# EAGLE design Node (EAGLE 6.1)
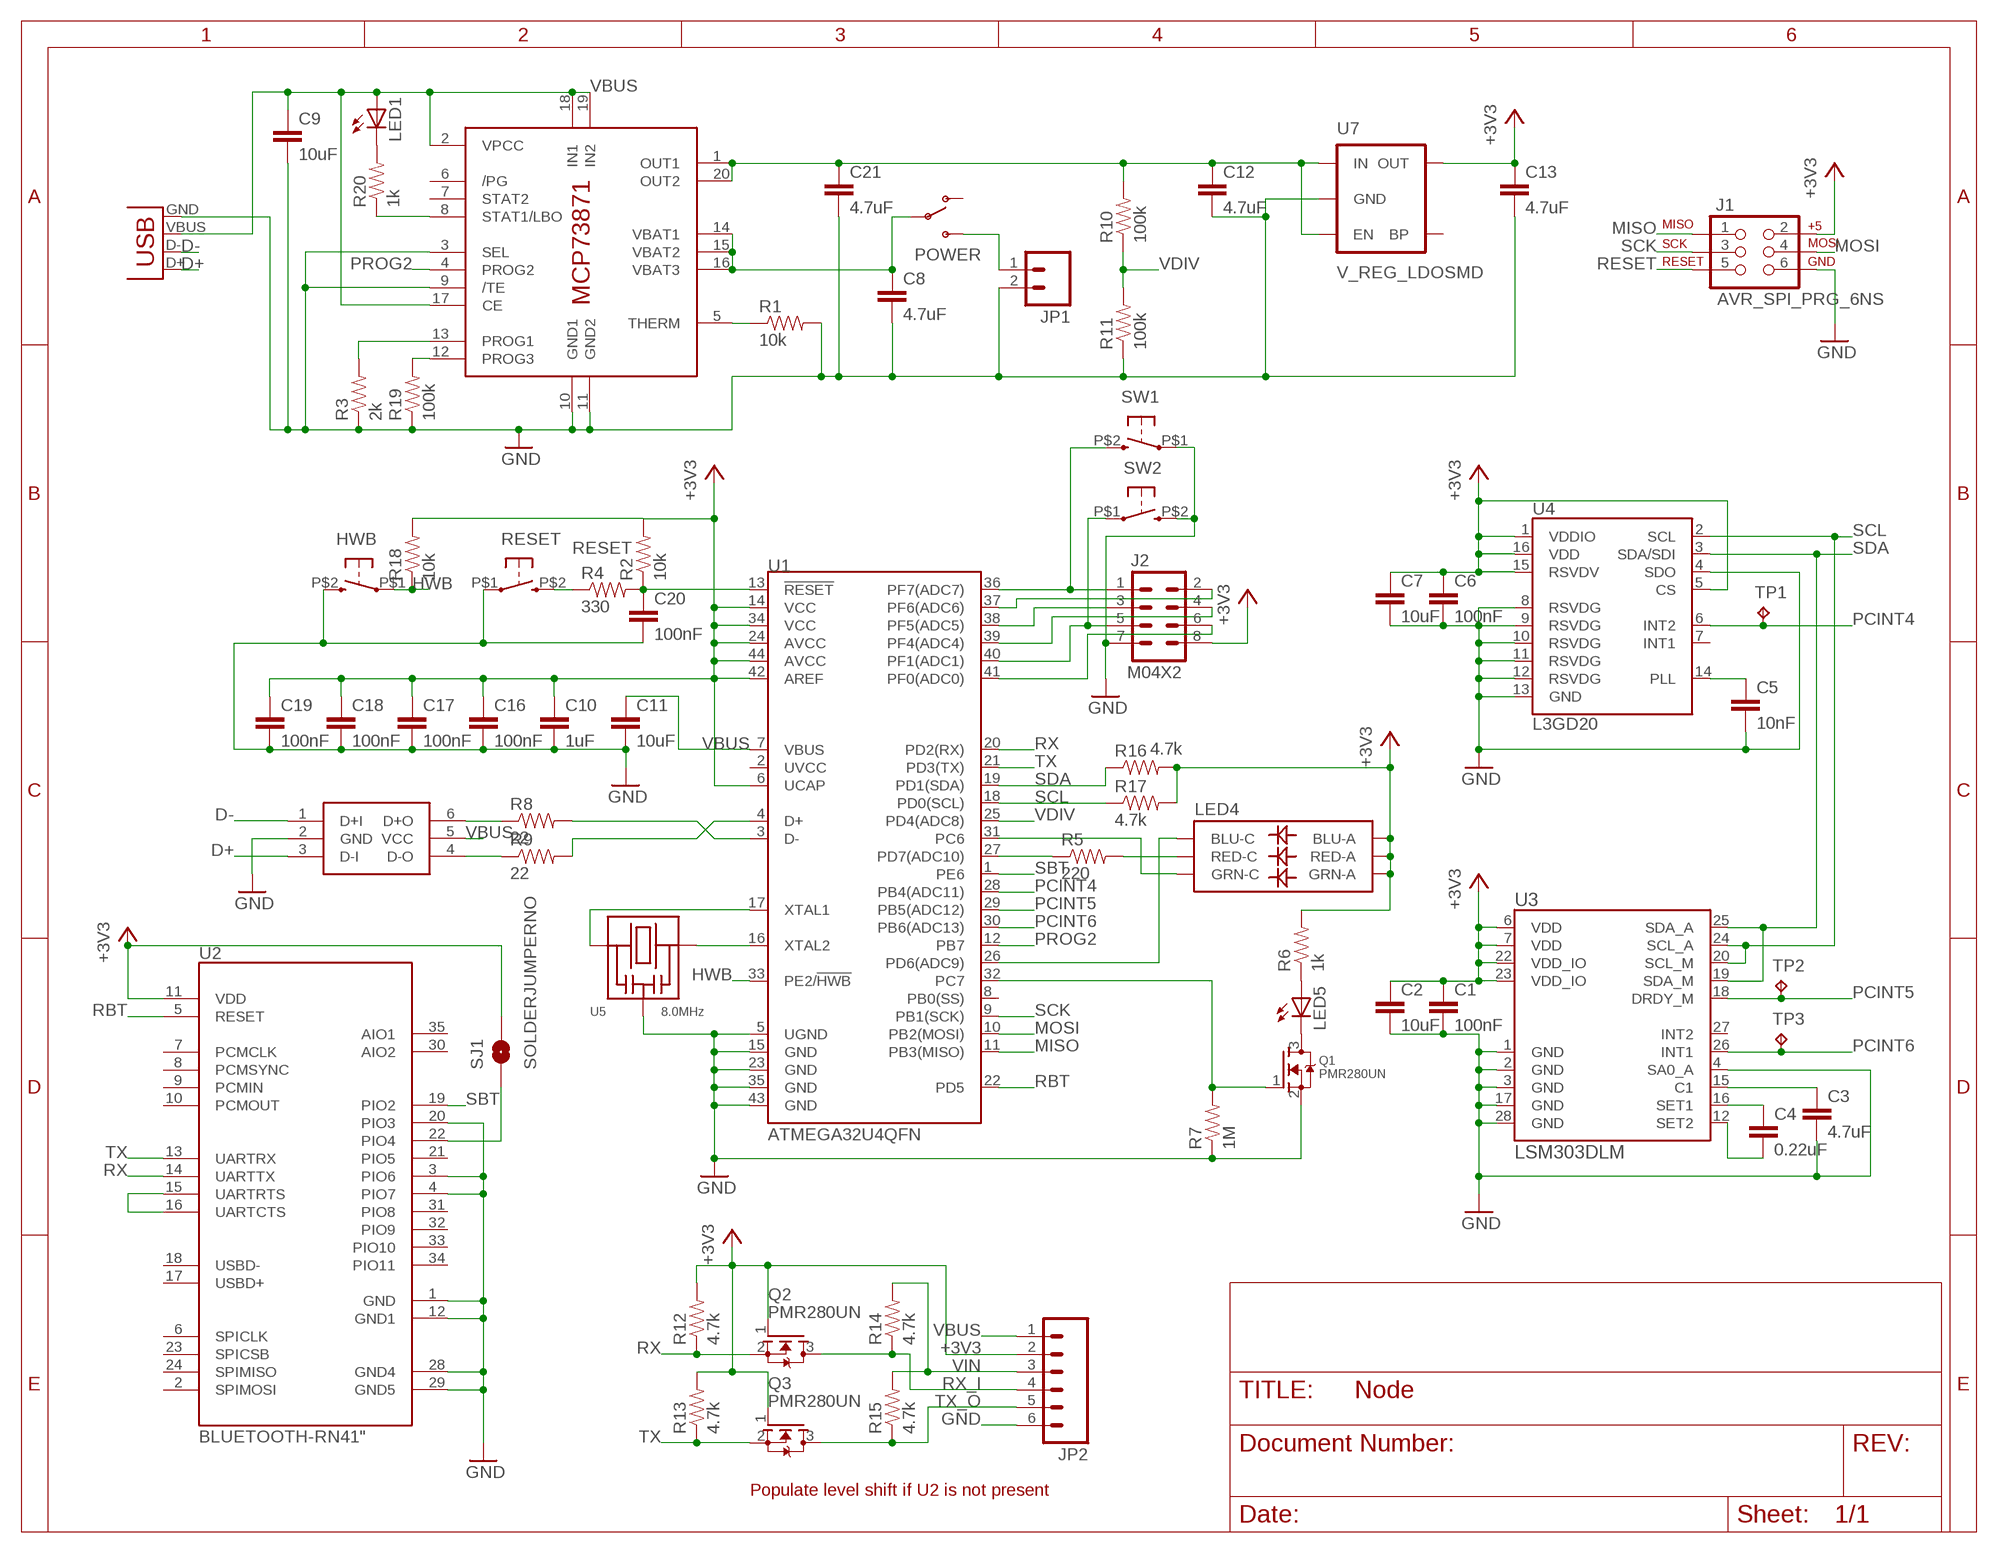
[diagram p0: schematic, sheet 1]

## Parts
C1  100nF  CAP0402-CAP  [0402-CAP]
C2  10uF  CAP0603-CAP  [0603-CAP]
C3  4.7uF  CAP0603-CAP  [0603-CAP]
C4  0.22uF  CAP0402-CAP  [0402-CAP]
C5  10nF  CAP0402-CAP  [0402-CAP]
C6  100nF  CAP0402-CAP  [0402-CAP]
C7  10uF  CAP0603-CAP  [0603-CAP]
C8  4.7uF  CAP0603-CAP  [0603-CAP]
C9  10uF  CAP0603-CAP  [0603-CAP]
C10  1uF  CAP0402-CAP  [0402-CAP]
C11  10uF  CAP0603-CAP  [0603-CAP]
C12  4.7uF  CAP0603-CAP  [0603-CAP]
C13  4.7uF  CAP0603-CAP  [0603-CAP]
C16  100nF  CAP0402-CAP  [0402-CAP]
C17  100nF  CAP0402-CAP  [0402-CAP]
C18  100nF  CAP0402-CAP  [0402-CAP]
C19  100nF  CAP0402-CAP  [0402-CAP]
C20  100nF  CAP0402-CAP  [0402-CAP]
C21  4.7uF  CAP0603-CAP  [0603-CAP]
HWB  KSS  [KSS]
J1  AVR_SPI_PRG_6NS  [2X3-NS]
J2  M04X2  [2X4]
JP1  M02-JST-2MM-SMT  [JST-2-SMD]
JP2  M06SIP  [1X06]
LED1  LED0603  [LED-0603]
LED4  LED-TRICOLOR-5050LED-TRICOLOR-0606  [0606]
LED5  LED0603  [LED-0603]
POWER  SWITCH-SPST-SMD-A  [SWITCH-SPST-SMD-A]
Q1  PMR280UN  MOSFET-N  [SOT416]
Q2  PMR280UN  MOSFET-N  [SOT416]
Q3  PMR280UN  MOSFET-N  [SOT416]
R1  10k  RESISTOR0402-RES  [0402-RES]
R2  10k  RESISTOR0402-RES  [0402-RES]
R3  2k  RESISTOR0402-RES  [0402-RES]
R4  330  RESISTOR0402-RES  [0402-RES]
R5  220  RESISTOR0402-RES  [0402-RES]
R6  1k  RESISTOR0402-RES  [0402-RES]
R7  1M  RESISTOR0402-RES  [0402-RES]
R8  22  RESISTOR0402-RES  [0402-RES]
R9  22  RESISTOR0402-RES  [0402-RES]
R10  100k  RESISTOR0402-RES  [0402-RES]
R11  100k  RESISTOR0402-RES  [0402-RES]
R12  4.7k  RESISTOR0402-RES  [0402-RES]
R13  4.7k  RESISTOR0402-RES  [0402-RES]
R14  4.7k  RESISTOR0402-RES  [0402-RES]
R15  4.7k  RESISTOR0402-RES  [0402-RES]
R16  4.7k  RESISTOR0402-RES  [0402-RES]
R17  4.7k  RESISTOR0402-RES  [0402-RES]
R18  10k  RESISTOR0402-RES  [0402-RES]
R19  100k  RESISTOR0402-RES  [0402-RES]
R20  1k  RESISTOR0402-RES  [0402-RES]
RESET  KSS  [KSS]
SJ1  SOLDERJUMPERNO  [SJ_2S-NO]
SW1  KSS  [KSS]
SW2  KSS  [KSS]
TP1  TPTP06R  [TP06R]
TP2  TPTP06R  [TP06R]
TP3  TPTP06R  [TP06R]
U1  ATMEGA32U4QFN  [QFN-44]
U2  BLUETOOTH-RN41"  [RN41]
U3  LSM303DLM  [LGA28-5X5]
U4  L3GD20  [LGA16-4X4]
U5  8.0MHz  RESONATOR  [SMT_RESONATOR_3731]
U6  MCP73871  [QFN20]
U7  V_REG_LDOSMD  [SOT23-5]
U9  RCLAMP0502A  [SOT-666]
X1  USBSMD  [USB-MINIB]

## Nets
+3V3: C1.1 C2.1 C6.1 C7.1 C10.1 C13.1 C16.1 C17.1 C18.1 C19.1 J1.2 J2.8 JP2.2 LED4.4(BLU-A) LED4.5(RED-A) LED4.6(GRN-A) Q2.1(G) Q3.1(G) R2.2 R6.2 R12.2 R13.2 R16.2 R17.2 R18.2 SJ1.2 U1.6(UCAP) U1.14(VCC) U1.24(AVCC) U1.34(VCC) U1.42(AREF) U1.44(AVCC) U2.11(VDD) U3.6(VDD) U3.7(VDD) U3.22(VDD_IO) U3.23(VDD_IO) U4.1(VDDIO) U4.5(CS) U4.15(RSVDV) U4.16(VDD) U7.5(OUT)
D+: U9.3(D-I) X1.D+
D-: U9.1(D+I) X1.D-
GND: C1.2 C2.2 C3.2 C5.2 C6.2 C7.2 C8.2 C9.2 C10.2 C11.2 C12.2 C13.2 C16.2 C17.2 C18.2 C19.2 C20.2 C21.2 HWB.P$2 J1.6 J2.7 JP1.2 JP2.6 Q1.2(S) R1.2 R3.1 R7.1 R11.1 R19.1 RESET.P$1 SW1.P$1 SW2.P$2 U1.5(UGND) U1.15(GND) U1.23(GND) U1.35(GND) U1.43(GND) U2.1(GND) U2.3(PIO6) U2.4(PIO7) U2.12(GND1) U2.20(PIO3) U2.28(GND4) U2.29(GND5) U3.1(GND) U3.2(GND) U3.3(GND) U3.4(SA0_A) U3.17(GND) U3.28(GND) U4.4(SDO) U4.8(RSVDG) U4.9(RSVDG) U4.10(RSVDG) U4.11(RSVDG) U4.12(RSVDG) U4.13(GND) U5.P$2(GND) U6.3(SEL) U6.9(/TE) U6.10(GND1) U6.11(GND2) U7.2(GND) U9.2(GND) X1.GND
HWB: HWB.P$1 R18.1 U1.33(PE2/!HWB)
MISO: J1.1 U1.11(PB3(MISO))
MOSI: J1.4 U1.10(PB2(MOSI))
N$1: U1.16(XTAL2) U5.P$3
N$2: U1.17(XTAL1) U5.P$1
N$3: C3.1 U3.15(C1)
N$4: C8.1 POWER.2(P) U6.14(VBAT1) U6.15(VBAT2) U6.16(VBAT3)
N$5: C4.1 U3.16(SET1)
N$6: C4.2 U3.12(SET2)
N$7: C5.1 U4.14(PLL)
N$8: R1.1 U6.5(THERM)
N$9: U2.15(UARTRTS) U2.16(UARTCTS)
N$10: LED4.2(RED-C) R5.2
N$11: C12.1 C21.1 R10.2 U6.1(OUT1) U6.20(OUT2) U7.1(IN) U7.3(EN)
N$12: LED4.3(GRN-C) U1.31(PC6)
N$13: LED1.C R20.2
N$14: SJ1.1 U2.22(PIO4)
N$15: R8.2 U1.3(D-)
N$16: R3.2 U6.13(PROG1)
N$17: LED4.1(BLU-C) U1.26(PD6(ADC9))
N$18: R5.1 U1.27(PD7(ADC10))
N$19: R20.1 U6.8(STAT1/LBO)
N$20: LED5.C Q1.3(D)
N$21: LED5.A R6.1
N$22: Q1.1(G) R7.2 U1.32(PC7)
N$24: R9.2 U1.4(D+)
N$25: R8.1 U9.6(D+O)
N$26: R9.1 U9.4(D-O)
N$27: C20.1 R2.1 R4.2 U1.13(!RESET)
N$28: J2.1 SW1.P$2 U1.36(PF7(ADC7))
N$29: JP1.1 POWER.3(S)
N$30: J2.2 U1.37(PF6(ADC6))
N$32: J2.3 U1.38(PF5(ADC5))
N$33: J2.4 U1.39(PF4(ADC4))
N$34: J2.5 SW2.P$1 U1.40(PF1(ADC1))
N$35: J2.6 U1.41(PF0(ADC0))
N$36: R19.2 U6.12(PROG3)
PCINT4: TP1.TP U1.28(PB4(ADC11)) U4.6(INT2)
PCINT5: TP2.TP U1.29(PB5(ADC12)) U3.18(DRDY_M)
PCINT6: TP3.TP U1.30(PB6(ADC13)) U3.26(INT1)
PROG2: U1.12(PB7) U6.4(PROG2)
RBT: U1.22(PD5) U2.5(RESET)
RESET: J1.5 R4.1 RESET.P$2
RX: Q2.2(S) R12.1 U1.20(PD2(RX)) U2.14(UARTTX)
RX_I: JP2.4 Q2.3(D) R14.1
SBT: U1.1(PE6) U2.19(PIO2)
SCK: J1.3 U1.9(PB1(SCK))
SCL: R17.1 U1.18(PD0(SCL)) U3.20(SCL_M) U3.24(SCL_A) U4.2(SCL)
SDA: R16.1 U1.19(PD1(SDA)) U3.19(SDA_M) U3.25(SDA_A) U4.3(SDA/SDI)
TX: Q3.2(S) R13.1 U1.21(PD3(TX)) U2.13(UARTRX)
TX_O: JP2.5 Q3.3(D) R15.1
VBUS: C9.1 C11.1 JP2.1 LED1.A U1.7(VBUS) U6.2(VPCC) U6.17(CE) U6.18(IN1) U6.19(IN2) U9.5(VCC) X1.VBUS
VDIV: R10.1 R11.2 U1.25(PD4(ADC8))
VIN: JP2.3 R14.2 R15.2
Unconnected: POWER.1(O) U1.2(UVCC) U1.8(PB0(SS)) U2.2(SPIMOSI) U2.6(SPICLK) U2.7(PCMCLK) U2.8(PCMSYNC) U2.9(PCMIN) U2.10(PCMOUT) U2.17(USBD+) U2.18(USBD-) U2.21(PIO5) U2.23(SPICSB) U2.24(SPIMISO) U2.30(AIO2) U2.31(PIO8) U2.32(PIO9) U2.33(PIO10) U2.34(PIO11) U2.35(AIO1) U3.27(INT2) U4.7(INT1) U6.6(/PG) U6.7(STAT2) U7.4(BP)

## Notes on the sheet
- Populate level shift if U2 is not present

## Library data of the parts
C1-C13 C16-C21 = SparkFun:CAP: Capacitor Standard 0603 ceramic capacitor, and 0.1" leaded capacitor.
HWB RESET SW1 SW2 = adjacent-reality:KSS: KSS Series Subminiature SMT Side Actuated Momentary Tactile Switch
J1 = SparkFun:AVR_SPI_PRG_6: AVR ISP 6 Pin This is the reduced ISP connector for AVR programming. Common on Arduino. This footprint will take up less PCB space and can be used with a 10-pin to 6-pin adapter such as SKU: BOB-08508
J2 = SparkFun:M04X2
JP1 = SparkFun:M02: Header 2 Standard 2-pin 0.1" header. Use with straight break away headers (SKU : PRT-00116), right angle break away headers (PRT-00553), swiss pins (PRT-00743), machine pins (PRT-00117), and female headers (PRT-00115). Molex polarized connector foot print use with SKU : PRT-08233 with associated crimp pins and housings.
JP2 = SparkFun:M06: Header 6 Standard 6-pin 0.1" header. Use with straight break away headers (SKU : PRT-00116), right angle break away headers (PRT-00553), swiss pins (PRT-00743), machine pins (PRT-00117), and female headers (PRT-00115). Molex polarized connector foot print use with SKU : PRT-08094 with associated crimp pins and housings. NOTES ON THE VARIANTS LOCK and LOCK_LONGPADS... This footprint was designed to help hold the alignment of a through-hole component (i.e. 6-pin header) while soldering it into place. You may notice that each hole has been shifted either up or down by 0.005 of an inch from it's more standard position (which is a perfectly straight line). This slight alteration caused the pins (the squares in the middle) to touch the edges of the holes. Because they are alternating, it causes a "brace" to hold the component in place. 0.005 has proven to be the perfect amount of "off-center" position when using our standard breakaway headers. Although looks a little odd when you look at the bare footprint, once you have a header in there, the alteration is very hard to notice. Also, if you push a header all the way into place, it is covered up entirely on the bottom side. This idea of altering the position of holes to aid alignment will be further integrated into the Sparkfun Library for other footprints. It can help hold any component with 3 or more connection pins.
LED1 LED5 = SparkFun:LED: LEDs Standard schematic elements and footprints for 5mm, 3mm, 1206, and 0603 sized LEDs. 5mm - Spark Fun Electronics SKU : COM-00529 (and others)
LED4 = adjacent-reality:LED-TRICOLOR-5050
POWER = SparkFun:SWITCH-SPST: SPST Switch Simple slide switch. Spark Fun Electronics SKU : COM-00102
Q1-Q3 = adjacent-reality:MOSFET-N: N-Channel Mosfet 2N7002E - 60V 260mA SOT23 [Digikey: 2N7002ET1GOSTR-ND] - REEL BSH103 - 30V 850mA SOT23 [Digikey: 568-5013-1-ND]
R1-R20 = SparkFun:RESISTOR: Resistor Basic schematic elements and footprints for 0603, 1206, and PTH resistors.
SJ1 = SparkFun:SOLDERJUMPER: Solder Jumper Standard SMD solder jumper. Used to automate production. Two varients : Normally Open and Normally Closed are the same, but have different paste layers. NC will have a large amount of paste and should jumper during reflow.
TP1-TP3 = testpad:TP: Test pad
U1 = adjacent-reality:ATMEGA32U4
U2 = adjacent-reality:BLUETOOTH-RN41: The RN42 is a small form factor, low power, highly economic Bluetooth radio for OEM’s adding wireless capability to their products.
U3 = adjacent-reality:LSM303DLM: The LSM303DLM is a system-in-package featuring a 3D digital linear acceleration sensor and a 3D digital magnetic sensor.
U4 = adjacent-reality:L3GD20: The L3GD20 is a low-power three-axis angular rate sensor.
U5 = adjacent-reality:RESONATOR: From UBW USB Bit Whacker by Brian Schmalz
U6 = adafruit:MCP73871
U7 = SparkFun:V_REG_LDO: Voltage Regulator LDO Standard 150mA LDO voltage regulator in SOT-23 layout. Micrel part MIC5205. BP (by-pass) pin is used to lower output noise with 470pF cap.
U9 = adjacent-reality:RCLAMP0502A: The RailClamp® series consists of ultra low capacitance TVS arrays designed to protect high speed data interfaces.
X1 = SparkFun:USB: USB Connectors USB-B-PTH is fully proven SKU : PRT-00139 USB-miniB is fully proven SKU : PRT-00587 USB-A-PCB is untested. USB-A-H is throughly reviewed, but untested. Spark Fun Electronics SKU : PRT-00437 USB-B-SMT is throughly reviewed, but untested. Needs silkscreen touching up. USB-A-S has not been used/tested USB-MB-H has not been used/tested

## Board
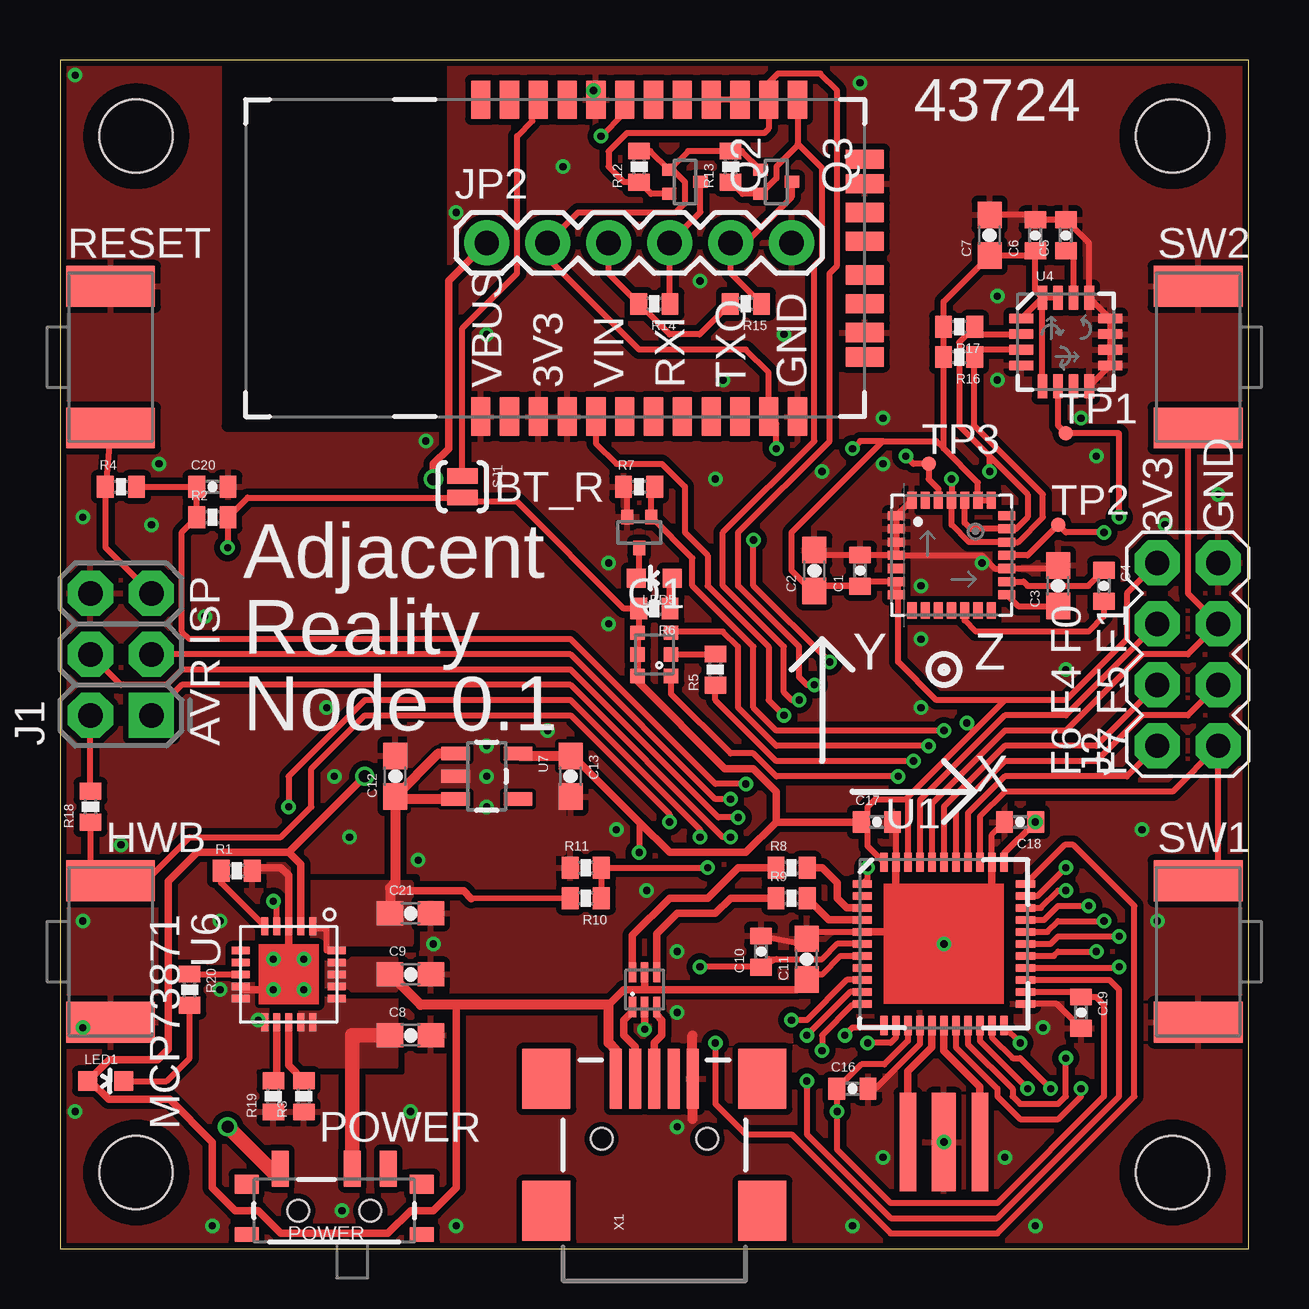
[diagram p1: board, top side]
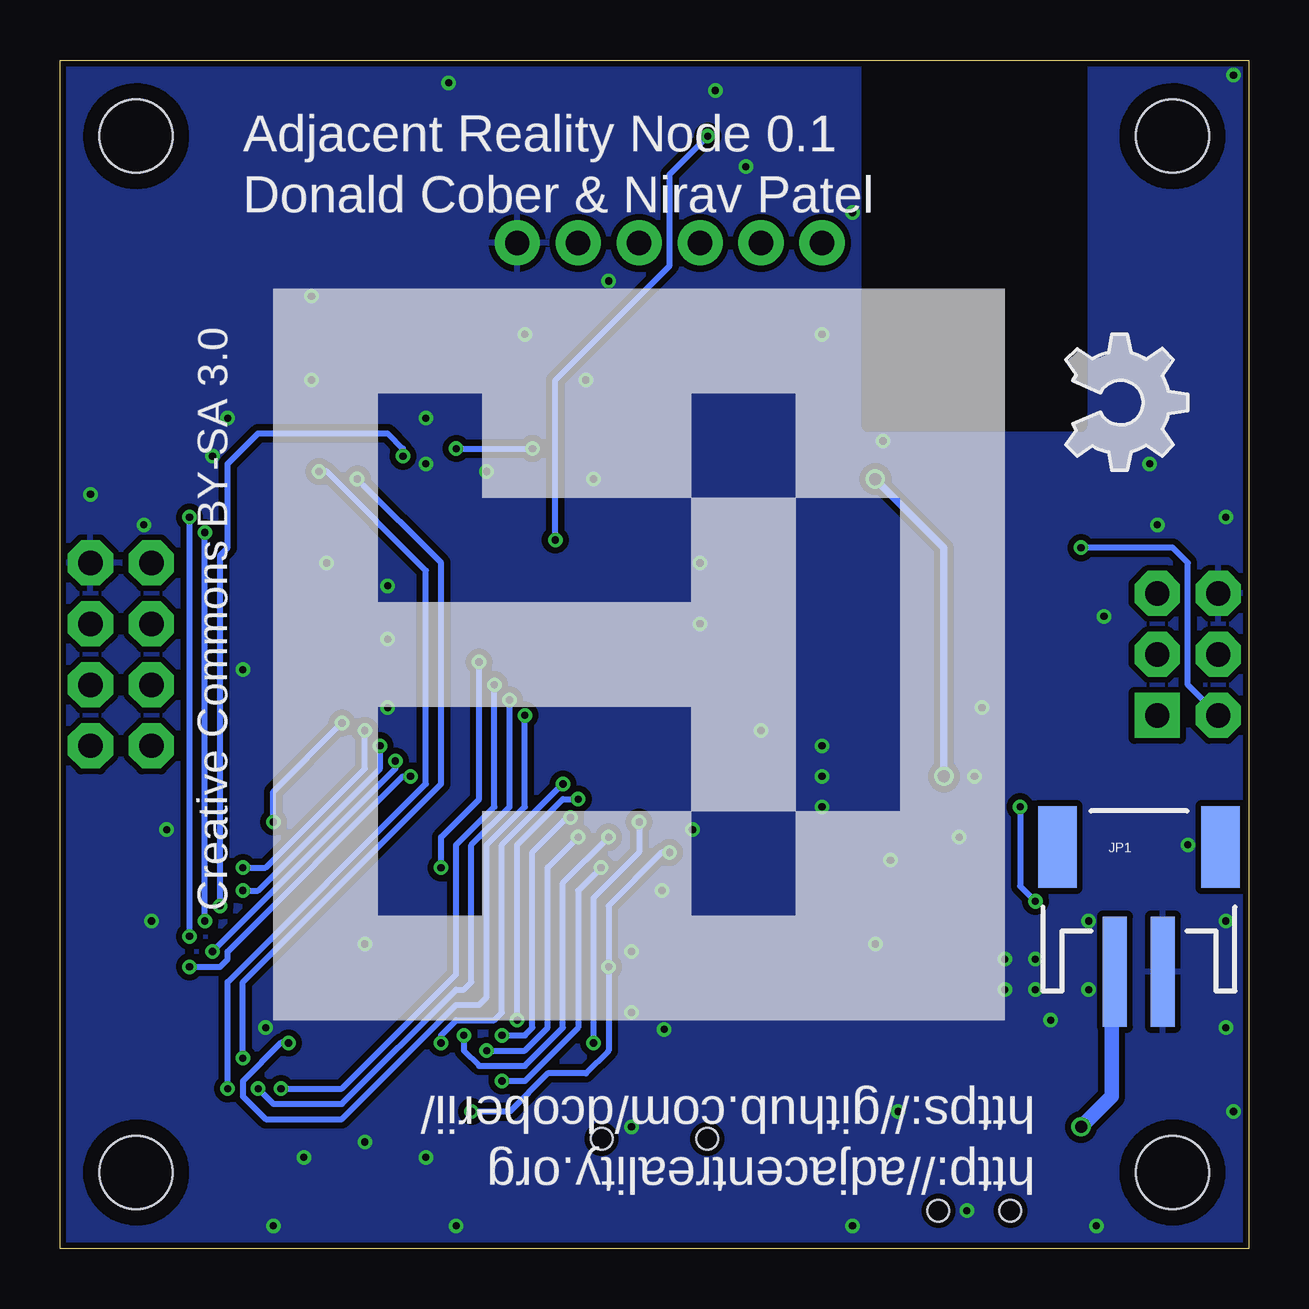
[diagram p2: board, bottom side, seen from below]

Size 49.53 x 49.53 mm. Coordinates in mm from the lower left corner, seen from the top.
Outline: 0,0 49.53,0 49.53,49.53 0,49.53 0,0
Copper layers (1*16): Top 0.035mm / dielectric 1.5mm / Bottom 0.035mm
Design rules: minimum track width 6mil, minimum drill 0.3mm, track to track 6mil, track to pad 6mil, pad to pad 6mil, via to via 6mil, smd to smd 0mil, copper to edge 10mil, drill to drill 10mil, minimum pad ring 10mil, minimum via ring 6mil, stop-mask expansion 2mil, vias tented up to drill 100mil, thermal gap 10mil
tKeepout: area 7,34.3 to 15.9,49.5
bKeepout: area 7,34.3 to 15.9,49.5
tRestrict: area 7,34.3 to 15.9,49.5
bRestrict: area 7,34.3 to 15.9,49.5

### Footprints (pad centres in the part's own frame; a part is rotated, then mirrored left to right if it is on the bottom)
0402-CAP = smd 0.7 x 0.9: 1 -0.65,0; 2 0.65,0
0603-CAP = smd 1.1 x 1: 1 -0.85,0; 2 0.85,0
KSS = smd 1.7 x 3.7: P$1 -2.95,0; P$2 2.95,0
2X3-NS = drill 1.016 pad 1.88 square: 1 -2.54,-1.27 | drill 1.016 pad 1.88 octagon: 2 -2.54,1.27; 3 0,-1.27; 4 0,1.27; 5 2.54,-1.27; 6 2.54,1.27
2X4 = drill 1.016 pad 1.88 octagon: 1 -3.81,-1.27; 2 -3.81,1.27; 3 -1.27,-1.27; 4 -1.27,1.27; 5 1.27,-1.27; 6 1.27,1.27; 7 3.81,-1.27; 8 3.81,1.27
JST-2-SMD = smd 1 x 4.6: 1 -1,-3.7; 2 1,-3.7 | smd 1.6 x 3.4: NC1 -3.4,1.5; NC2 3.4,1.5
1X06 = drill 1.016 pad 1.88: 1 0,0; 2 2.54,0; 3 5.08,0; 4 7.62,0; 5 10.16,0; 6 12.7,0
LED-0603 = smd 0.8 x 0.8: A 0,-0.75; C 0,0.75
0606 = smd 0.6 x 0.6: 1 -0.7,0.9; 2 -0.7,0; 3 -0.7,-0.9; 4 0.7,0.9; 5 0.7,0; 6 0.7,-0.9
SWITCH-SPST-SMD-A = smd 0.7 x 1.5: 1 -2.25,-1.75; 2 -0.75,-1.75; 3 2.25,-1.75 | smd 1 x 0.6: GND1 -3.65,1; GND3 3.65,1 | smd 1 x 0.8: GND2 -3.65,-1.1; GND4 3.65,-1.1 | hole 0.9: -1.5,0; 1.5,0
SOT416 = smd 0.5 x 0.6: 1 -0.5,-0.65; 2 0.5,-0.65; 3 0,0.65
0402-RES = smd 0.7 x 0.9: 1 -0.65,0; 2 0.65,0
SJ_2S-NO = smd 0.635 x 1.27: 1 -0.45,0; 2 0.45,0
TP06R = smd 0.6 x 0.6: TP 0,0
QFN-44 = smd 0.8 x 0.3: 1 -3.4,2.5; 2 -3.4,2; 3 -3.4,1.5; 4 -3.4,1; 5 -3.4,0.5; 6 -3.4,0; 7 -3.4,-0.5; 8 -3.4,-1; 9 -3.4,-1.5; 10 -3.4,-2; 11 -3.4,-2.5; 23 3.4,-2.5; 24 3.4,-2; 25 3.4,-1.5; 26 3.4,-1; 27 3.4,-0.5; 28 3.4,0; 29 3.4,0.5; 30 3.4,1; 31 3.4,1.5; 32 3.4,2; 33 3.4,2.5 | smd 0.3 x 0.8: 12 -2.5,-3.4; 13 -2,-3.4; 14 -1.5,-3.4; 15 -1,-3.4; 16 -0.5,-3.4; 17 0,-3.4; 18 0.5,-3.4; 19 1,-3.4; 20 1.5,-3.4; 21 2,-3.4; 22 2.5,-3.4; 34 2.5,3.4; 35 2,3.4; 36 1.5,3.4; 37 1,3.4; 38 0.5,3.4; 39 0,3.4; 40 -0.5,3.4; 41 -1,3.4; 42 -1.5,3.4; 43 -2,3.4; 44 -2.5,3.4
RN41 = smd 0.8 x 1.6: 1 -6.6,-6.6; 2 -5.4,-6.6; 3 -4.2,-6.6; 4 -3,-6.6; 5 -1.8,-6.6; 6 -0.6,-6.6; 7 0.6,-6.6; 8 1.8,-6.6; 9 3,-6.6; 10 4.2,-6.6; 11 5.4,-6.6; 12 6.6,-6.6; 13 6.6,6.6; 14 5.4,6.6; 15 4.2,6.6; 16 3,6.6; 17 1.8,6.6; 18 0.6,6.6; 19 -0.6,6.6; 20 -1.8,6.6; 21 -3,6.6; 22 -4.2,6.6; 23 -5.4,6.6; 24 -6.6,6.6 | smd 1.6 x 0.8: 28 9.4,3.1; 29 9.4,-3.1; 30 9.4,-4.122; 31 9.4,-1.9; 32 9.4,-0.7; 33 9.4,0.7; 34 9.4,1.9; 35 9.4,4.122
LGA28-5X5 = smd 0.7 x 0.381: 1 -2.3,1.65; 2 -2.3,1.1; 3 -2.3,0.55; 4 -2.3,0; 5 -2.3,-0.55; 6 -2.3,-1.1; 7 -2.3,-1.65; 15 2.3,-1.65; 16 2.3,-1.1; 17 2.3,-0.55; 18 2.3,0; 19 2.3,0.55; 20 2.3,1.1; 21 2.3,1.65 | smd 0.381 x 0.7: 8 -1.65,-2.3; 9 -1.1,-2.3; 10 -0.55,-2.3; 11 0,-2.3; 12 0.55,-2.3; 13 1.1,-2.3; 14 1.65,-2.3; 22 1.65,2.3; 23 1.1,2.3; 24 0.55,2.3; 25 0,2.3; 26 -0.55,2.3; 27 -1.1,2.3; 28 -1.65,2.3
LGA16-4X4 = smd 1 x 0.4: 1 -1.85,0.975; 2 -1.85,0.325; 3 -1.85,-0.325; 4 -1.85,-0.975; 9 1.85,-0.975; 10 1.85,-0.325; 11 1.85,0.325; 12 1.85,0.975 | smd 0.4 x 1: 5 -0.975,-1.85; 6 -0.325,-1.85; 7 0.325,-1.85; 8 0.975,-1.85; 13 0.975,1.85; 14 0.325,1.85; 15 -0.325,1.85; 16 -0.975,1.85
SMT_RESONATOR_3731 = smd 0.7 x 4.1: P$1 -1.5,0; P$3 1.5,0 | smd 1 x 4.1: P$2 0,0
QFN20 = smd 0.75 x 0.3: 1 -2,1; 2 -2,0.5; 3 -2,0; 4 -2,-0.5; 5 -2,-1; 11 2,-1; 12 2,-0.5; 13 2,0; 14 2,0.5; 15 2,1 | smd 0.3 x 0.75: 6 -1,-2; 7 -0.5,-2; 8 0,-2; 9 0.5,-2; 10 1,-2; 16 1,2; 17 0.5,2; 18 0,2; 19 -0.5,2; 20 -1,2
SOT23-5 = smd 0.55 x 1.2: 1 -0.95,-1.3; 2 0,-1.3; 3 0.95,-1.3; 4 0.95,1.3; 5 -0.95,1.3
SOT-666 = smd 0.305 x 0.838: 1 -0.508,-0.724; 2 0,-0.724; 3 0.508,-0.724; 4 0.508,0.724; 5 0,0.724; 6 -0.508,0.724
STAND-OFF-TIGHT = hole 3.048: 0,0
USB-MINIB = smd 2.5 x 0.5: D+ 2.5,0; D- 2.5,0.8; GND 2.5,-1.6; ID 2.5,-0.8; VBUS 2.5,1.6 | smd 2.5 x 2: MTN1 -3,4.5; MTN2 2.5,4.5; MTN3 -3,-4.5; MTN4 2.5,-4.5 | hole 0.9: 0,2.2; 0,-2.2

### Placement (x,y rotation side)
C1  33.34,28.26 90 top
C2  31.43,28.26 90 top
C3  41.59,27.62 90 top
C4  43.5,27.62 270 top
C5  41.91,42.23 90 top
C6  40.64,42.23 90 top
C7  38.73,42.23 90 top
C8  14.61,8.89 0 top
C9  14.61,11.43 0 top
C10  29.21,12.38 90 top
C11  31.11,12.06 90 top
C12  13.97,19.68 90 top
C13  21.27,19.68 270 top
C16  33.02,6.67 0 top
C17  34.04,17.78 0 top
C18  40.01,17.78 180 top
C19  42.55,9.84 270 top
C20  6.35,31.75 0 top
C21  14.61,13.97 0 top
HWB  2.11,12.38 270 top
J1  2.54,24.77 90 top
J2  46.99,24.77 90 top
JP1  4.57,15.24 0 bottom
JP2  17.78,41.91 0 top
LED1  1.91,6.99 270 top
LED4  24.77,24.77 180 top
LED5  24.77,27.94 90 top
OSHW  [OSHW_FILLX200_NOTEXT]  7.62,38.1 270 bottom
POWER  11.43,1.59 180 top
Q1  24.13,29.84 180 top
Q2  26.04,44.45 270 top
Q3  29.84,44.45 270 top
R1  7.37,15.75 0 top
R2  6.35,30.48 0 top
R3  10.16,6.35 90 top
R4  2.54,31.75 0 top
R5  27.3,24.13 90 top
R6  24.77,26.67 180 top
R7  24.13,31.75 0 top
R8  30.48,15.88 0 top
R9  30.48,14.61 0 top
R10  21.91,14.61 180 top
R11  21.91,15.88 0 top
R12  24.13,45.09 90 top
R13  27.94,45.09 90 top
R14  24.77,39.37 180 top
R15  28.57,39.37 180 top
R16  37.47,37.15 180 top
R17  37.47,38.42 180 top
R18  1.27,18.41 90 top
R19  8.89,6.35 90 top
R20  5.4,10.79 270 top
RESET  2.11,37.15 270 top
SJ1  16.76,31.75 270 top
SW1  47.42,12.38 90 top
SW2  47.42,37.15 90 top
TP1  41.91,33.97 0 top
TP2  41.59,30.16 0 top
TP3  36.2,32.7 0 top
U1  36.83,12.7 0 top
U2  24.13,41.27 0 top
U3  37.15,28.89 0 top
U4  41.91,37.78 0 top
U5  36.83,4.45 180 top
U6  9.53,11.43 270 top
U7  17.78,19.68 270 top
U9  24.36,10.79 0 top
U$1  [STAND-OFF-TIGHT]  3.17,3.17 0 top
U$2  [STAND-OFF-TIGHT]  3.17,46.35 0 top
U$3  [STAND-OFF-TIGHT]  46.35,46.35 0 top
U$4  [STAND-OFF-TIGHT]  46.35,3.17 0 top
X1  24.77,4.57 90 top

### Tracks (layer width: path | path; a pad name or v marks a point on that pad's centre or on a via)
+3V3  (via drill 0.3)
  Top 0.254: U4.15 U4.16 | U4.16 40.64,39.93 C6.1 40.44,41.38 C7.1 36.81,39.46 R17.2 R16.2 36.81,33.35 | U4.16 U4.1 | U4.5 U4.16 | U3.22 U3.23 38.25,31.92 36.81,33.35 | U3.7 U3.6 | U3.6 33.52,27.79 C1.1 31.63,27.61 C2.1 | C10.1 29.54,12.06 29.84,12.06 | 29.84,12.06 31.75,12.06 32.38,12.7 U1.6 | C18.1 39.33,16.45 U1.34 39.33,16.47 v40.64,17.78 | U1.24 42.45,10.7 arc90 42.55,10.48 C19.1 43.16,10.49 43.5,10.16 43.5,6.35 39.05,1.91 34.61,1.91 32.38,4.13 v32.38,5.71 32.38,6.65 C16.1 33.39,7.68 34.35,7.68 35.33,8.66 U1.14 | LED4.4 LED4.5 LED4.6 24.11,25.71 R6.2 23.5,26.67 19.05,31.11 16.83,31.11 16.83,31.43 16.76,31.37 SJ1.2 7.82,31.3 R2.2 7,29.23 v6.99,29.21 | Q2.1 24.6,45.73 R12.2 | Q2.1 26.17,45.73 R13.2 28.41,45.73 Q3.1 | Q2.1 25.54,44.95 26.04,44.45 26.04,43.56 25.65,43.18 21.59,43.18 JP2.2 20.32,41.27 24.13,37.47 28.57,37.47 29.53,36.51 U2.11 29.84,34.36 v29.84,33.34 | U1.44 33.66,16.77 33.66,17.78 C17.1 33.66,18.05 33.66,18.41 33.97,18.73 35.24,18.73 | 35.24,18.73 35.33,18.64 U1.42 | J2.8 44.45,27.3 44.45,25.4 41.91,22.86 39.37,22.86 | 39.37,22.86 38.1,21.59 | 38.1,21.59 35.24,18.73 | R18.2 J1.2 | 24.13,17.78 v24.13,16.51 | 39.37,22.86 36.51,22.86 34.92,24.45 34.92,27.71 U3.6 | U3.6 33.19,27.79 33.02,27.62 31.11,27.62 30.48,28.26 30.48,29.84 34.29,33.66 | 34.29,33.66 36.51,33.66 36.81,33.35 | 29.84,12.06 29.21,11.75 v26.67,11.75 | v37.78,21.91 38.1,21.59 | 34.29,33.66 33.34,33.66 v33.02,33.34
  Top 0.305: LED4.4 24.07,23.64 27.71,20 28.89,20 29.84,19.05 29.84,17.78 | C13.1 21.49,20.32 21.59,20.32 24.13,17.78 25.4,16.51 28.57,16.51 29.84,17.78 | 29.84,17.78 C17.1
  Top 0.406: U7.5 19.18,20.54 C13.1
  Bottom 0.254: J1.2 2.54,23.5 2.54,28.57 3.17,29.21 v6.99,29.21 | v24.13,16.51 24.45,16.51 26.67,14.29 v26.67,11.75 26.67,8.26 27.62,7.3 29.21,7.3 30.8,5.71 v32.38,5.71 | v40.64,17.78 40.64,19.05 v37.78,21.91 | v33.02,33.34 v29.84,33.34
D+
  Top 0.305: 24.87,7.17 X1.D+ 24.77,8.57 25.08,8.89 25.08,9.53 24.87,9.74 U9.3
D-
  Top 0.305: U9.1 23.85,9.88 23.5,9.53 23.5,8.89 23.96,8.42 X1.D-
GND  (via drill 0.3)
  Top 0.254: C7.2 40.44,43.08 C6.2 C5.2 42.88,41.9 U4.13 U4.12 U4.11 U4.10 U4.9 U4.8 | U3.28 U3.1 U3.2 U3.3 U3.4 | U3.4 38.42,28.89 38.97,28.34 U3.17 41.46,28.34 C3.2 | U3.4 31.65,28.89 C2.2 | U1.5 31.4,13.2 C11.2 30.91,12.71 C10.2 | C17.2 34.83,17.67 U1.43 | U1.35 38.83,17.25 C18.2 | C19.2 41.54,10.2 U1.23 | U1.15 35.83,8.53 33.97,6.67 C16.2 | Q1.2 23.63,31.6 R7.1 | 33.02,44.45 33.45,44.45 U2.28
  Top 0.305: R1.2 8.06,15.75 8.19,15.88 9.21,15.88 9.53,15.56 U6.3 9.53,11.75 8.57,10.79 7.66,10.79 U6.9 | U1.5 34.47,13.2 34.83,13.56 U1.43 | U1.35 38.83,14.7 v36.83,12.7 | U9.2 v24.36,9.14
  Top 0.406: 26.35,8.26 26.35,8.89 | 26.35,6.03 26.35,5.4
  other vias: 39.05,36.2 43.18,33.02 35.88,27.62 38.42,28.57 42.55,34.61 31.75,32.38 34.29,32.7 35.88,25.4 41.91,24.13 35.88,22.54 34.29,3.81 36.83,4.45 39.37,3.81 45.72,13.65 40.64,0.95 25.72,12.38 40.96,9.21 25.72,9.84 33.02,0.95 16.51,0.95 14.61,5.71 15.56,12.7 24.45,14.92 11.43,19.68 12.06,17.14 14.92,16.19 17.78,18.41 17.78,19.68 17.78,20.95 20.32,21.59 23.18,17.46 0.95,13.65 0.95,9.21 6.67,10.79 0.64,5.71 6.35,0.95 11.75,1.59 2.54,16.83 11.11,22.54 22.86,28.57 17.78,38.1 27.62,36.2 27.3,32.07 22.86,26.04 6.03,26.35 0.95,30.48 3.81,30.16 4.13,32.7 15.24,33.66 0.64,48.9 33.34,48.58 34.29,34.61 39.05,39.69 48.26,31.43 46.04,30.16 45.09,17.46 16.51,43.18 22.23,48.26 30.16,38.1 26.67,40.32 20.95,45.09 8.26,9.53 6.67,13.65 8.89,12.06 10.16,12.06 10.16,10.79 8.89,10.79 25.72,5.08
  pour Top (no thermals): 6.35,11.43 8.89,11.43 8.89,7.62 6.35,7.62
  pour Top (no thermals): 14.61,22.23 20.95,22.23 20.95,16.51 14.61,16.51
  pour Top (isolate 0.254, rank 6): 0,49.53 49.53,49.53 49.53,0 0,0
  pour Bottom (isolate 0.254, rank 6): 0,49.53 49.53,49.53 49.53,0 0,0
HWB  (via drill 0.3)
  Top 0.254: R18.1 1.27,15.88 1.91,15.24 2,15.33 HWB.P$1 3.58,15.33 5.4,17.14 9.21,17.14 10.48,18.41 10.48,20 12.7,22.23 21.27,22.23 25.4,18.1 v25.4,17.78 | v27.3,8.57 27.3,6.03 28.57,4.76 30.48,4.76 34.61,0.64 39.05,0.64 44.77,6.35 44.77,14.29 42.23,16.83 41.86,16.83 U1.33
  Bottom 0.254: v25.4,17.78 25.4,16.51 27.3,14.61 v27.3,8.57
MISO  (via drill 0.3)
  Top 0.254: U1.11 33.39,10.16 33.02,10.16 31.75,8.89 v31.75,8.26 | v27.94,17.14 27.62,17.14 21.27,23.5 5.08,23.5 J1.1
  Bottom 0.254: v31.75,8.26 30.16,8.26 29.21,9.21 29.21,15.88 v27.94,17.14
MOSI  (via drill 0.3)
  Top 0.254: U1.10 32.92,10.7 v31.11,8.89 | J1.4 2.54,23.5 4.45,23.5 5.08,24.13 21.27,24.13 27.43,17.97 v28.26,17.97
  Bottom 0.254: v31.11,8.89 30.16,8.89 29.84,9.21 29.84,16.51 28.38,17.97 v28.26,17.97
N$1
  Top 0.305: U1.16 36.33,8.39 35.33,7.39 U5.P$3
N$2
  Top 0.305: U1.17 36.83,8.26 38.33,6.75 U5.P$1
N$3
  Top 0.254: U3.15 39.92,26.77 C3.1
N$4
  Top 0.61: POWER.2 12.18,8.89 C8.1
  pour Top (isolate 0.254, rank 4, no thermals): 10.16,10.79 13.97,10.79 13.97,7.62 9.53,7.62 9.53,10.79
N$5
  Top 0.254: U3.16 40.15,27.79 40.32,27.62 42.85,27.62 C4.1
N$6
  Top 0.254: C4.2 43.5,26.35 42.86,25.72 38.16,25.72 37.7,26.18 U3.12
N$7
  Top 0.254: U4.14 42.23,41.25 C5.1
N$8
  Top 0.254: R1.1 6.72,15.24 U6.5
N$9
  Top 0.254: U2.15 U2.16
N$10
  Top 0.254: LED4.2 27.29,24.77 R5.2
N$11
  Top 0.254: R10.2 17.14,14.59 | U6.20 11.11,12.43 11.11,13.34 10.62,13.34 U6.1
  Top 0.305: 17.14,14.59 16.81,14.92 13.97,14.92
  Top 0.406: C12.1 13.97,15.24 13.76,15.03 C21.1 | C12.1 15.77,20.64 U7.1 | U7.3 14.07,18.73 arc-90 C12.1
  pour Top (isolate 0.254, rank 4, no thermals): 14.61,15.24 14.61,12.7 10.16,12.7 10.16,15.24
N$12  (via drill 0.3)
  Top 0.254: U1.31 40.87,14.2 41.59,14.92 v41.91,14.92 | v36.2,20.95 29.84,20.95 28.26,22.54 28.26,25.08 27.62,25.72 25.52,25.72 LED4.3
  Bottom 0.254: v41.91,14.92 41.27,14.92 36.2,20 v36.2,20.95
N$13
  Top 0.254: LED1.C 4.45,6.99 5.4,7.94 R20.2
N$14
  Top 0.254: SJ1.1 16.76,38.35 19.05,40.64 19.05,46.35 19.68,46.99 19.68,47.63 U2.22
N$15
  Top 0.305: U1.3 32.79,14.2 32.38,14.61 32.38,15.24 31.75,15.88 R8.2 31.11,15.88
N$16
  Top 0.305: R3.2 9.53,7.63 U6.13
N$17  (via drill 0.3)
  Top 0.254: U1.26 44.09,11.7 v44.13,11.75 | v34.92,19.68 29.84,19.68 28.89,20.64 27.94,20.64 25.46,23.11 LED4.1
  Bottom 0.254: v44.13,11.75 42.86,11.75 42.55,12.06 42.55,12.38 35.24,19.68 v34.92,19.68
N$18  (via drill 0.3)
  Top 0.254: U1.27 41.41,12.2 41.59,12.38 v43.18,12.38 | v35.56,20.32 29.84,20.32 27.3,22.86 R5.1
  Bottom 0.254: v43.18,12.38 35.56,20 v35.56,20.32
N$19
  Top 0.254: R20.1 7.51,11.45 U6.8
N$20
  Top 0.254: Q1.3 24.13,27.94 LED5.C
N$21
  Top 0.254: R6.1 25.41,27.93 25.4,27.94 25.4,27.82 | R6.1 25.4,27.82 | 25.4,27.82 LED5.A
N$22  (via drill 0.3)
  Top 0.254: R7.2 24.63,31.6 Q1.1 26.35,28.77 26.35,27.62 28.89,25.08 28.89,22.54 29.84,21.59 v36.83,21.59 | U1.32 40.73,14.7 v41.91,15.88
  Bottom 0.254: v41.91,15.88 40.96,15.88 36.83,20 v36.83,21.59
N$24
  Top 0.305: U1.4 32.03,13.7 R9.2
N$25
  Top 0.305: U9.6 23.85,13.06 25.4,14.61 26.99,14.61 28.26,15.88 R8.1
N$26
  Top 0.305: U9.4 24.87,13.12 25.72,13.97 27.3,13.97 27.94,14.61 R9.1
N$27  (via drill 0.3)
  Top 0.254: R4.2 C20.1 5.7,31.73 | 5.7,31.73 R2.1 5.08,29.86 5.08,25.72 5.4,25.4 21.27,25.4 27.3,19.37 v28.57,19.37 | 5.7,31.73 5.71,31.75 | U1.13 34.83,8.79 34.61,8.57 v33.66,8.57
  Bottom 0.254: v33.66,8.57 33.66,8.89 33.02,9.53 31.43,9.53 31.11,9.84 31.11,16.83 v28.57,19.37
N$28
  Top 0.254: U1.36 38.33,18.01 39.37,19.05 46.35,19.05 J2.1 48.26,15.97 SW1.P$2
N$29  (via drill 0.5)
  Top 0.61: POWER.3 8.92,3.15 v6.99,5.08
  Bottom 0.305: 5.71,10.16 5.71,11.4 JP1.1
  Bottom 0.61: v6.99,5.08 5.71,6.35 5.71,10.16
N$30
  Top 0.254: J2.2 44.45,19.68 39.37,19.68 37.83,18.14 U1.37
N$32
  Top 0.254: J2.3 46.99,22.23 45.09,22.23 43.18,20.32 39.37,20.32 37.33,18.28 U1.38
N$33
  Top 0.254: J2.4 43.18,20.95 39.37,20.95 36.83,18.41 U1.39
N$34
  Top 0.254: U1.40 36.33,18.55 39.37,21.59 41.91,21.59 45.09,24.77 46.99,24.77 J2.5 46.99,27.3 46.99,33.56 SW2.P$1
N$35
  Top 0.254: J2.6 41.91,22.23 39.37,22.23 35.83,18.68 U1.41
N$36
  Top 0.305: R19.2 9.03,7.13 U6.12
PCINT4  (via drill 0.3)
  Top 0.254: U1.28 41.27,12.7 41.59,13.02 v44.13,13.02 | v44.13,30.48 44.13,33.97 TP1.TP 41.59,34.3 U4.6
  Bottom 0.254: v44.13,13.02 v44.13,30.48
PCINT5  (via drill 0.3)
  Top 0.254: U1.29 41.14,13.2 41.59,13.65 v43.5,13.65 | v43.5,29.84 41.91,29.84 TP2.TP 40.32,28.89 U3.18
  Bottom 0.254: v43.5,13.65 v43.5,29.84
PCINT6  (via drill 0.3)
  Top 0.254: U1.30 41.01,13.7 41.59,14.29 v42.86,14.29 | v35.24,33.02 35.56,32.7 TP3.TP 36.2,32.07 36.6,31.66 U3.26
  Bottom 0.254: v42.86,14.29 42.86,28.89 42.55,29.21 42.55,32.7 41.27,33.97 35.88,33.97 35.24,33.34 v35.24,33.02
PROG2  (via drill 0.3)
  Top 0.254: U1.12 34.24,9.21 33.02,9.21 v32.7,8.89 | v9.53,18.41 9.53,19.68 12.7,22.86 21.27,22.86 26.67,17.46 v26.67,17.14 | U6.4 9.03,14.34 v8.89,14.48
  Bottom 0.254: v32.7,8.89 32.7,8.26 32.07,7.62 30.16,7.62 28.57,9.21 28.57,15.24 v26.67,17.14 | v9.53,18.41 9.53,15.11 v8.89,14.48
RBT  (via drill 0.3)
  Top 0.254: U2.5 22.33,33.55 23.18,32.7 25.08,32.7 26.04,31.75 26.04,29.84 26.99,28.89 26.99,27.62 29.53,25.08 29.53,22.86 v30.16,22.23 | U1.22 39.33,9.25 v40.01,8.57
  Bottom 0.254: v40.01,8.57 40.32,8.57 41.91,6.99 41.91,6.35 40.96,5.4 37.78,5.4 33.02,10.16 32.07,10.16 31.75,10.48 31.75,16.83 30.16,18.41 v30.16,22.23
RESET
  Top 0.254: RESET.P$2 1.91,31.77 R4.1 1.91,31.73 1.91,29.21 J1.5
RX  (via drill 0.3)
  Top 0.254: Q2.2 24.63,43.95 R12.1 24.11,44.45 23.5,44.45 22.86,45.09 22.86,45.72 23.62,46.48 29.34,46.48 29.53,46.67 U2.14 29.53,48.58 29.91,48.96 31.69,48.96 32.38,48.26 32.38,40.96 32.07,40.64 32.07,33.66 28.26,29.84 28.26,27.62 30.8,25.08 30.8,23.81 31.11,23.5 v31.43,23.5 | U1.20 38.33,8.66 v40.32,6.67
  Bottom 0.254: v40.32,6.67 37.78,6.67 33.02,11.43 33.02,16.83 31.43,18.41 v31.43,23.5
RX_I
  Top 0.254: Q2.3 26.68,43.2 JP2.4 25.4,39.38 R14.1
SBT  (via drill 0.3)
  Top 0.254: U1.1 33.66,15.43 v33.66,15.88 | v32.07,24.45 28.89,27.62 v28.89,29.53 | v22.54,46.35 23.5,47.31 23.5,47.84 U2.19
  Bottom 0.254: v33.66,15.88 33.66,17.14 32.07,18.73 v32.07,24.45 | v28.89,29.53 28.89,36.2 24.13,40.96 24.13,44.77 v22.54,46.35
SCK  (via drill 0.3)
  Top 0.254: U1.9 32.79,11.2 31.11,9.53 v30.48,9.53 | v27.94,18.73 27.3,18.73 21.27,24.77 J1.3
  Bottom 0.254: v30.48,9.53 30.48,16.83 28.57,18.73 v27.94,18.73
SCL  (via drill 0.3)
  Top 0.254: U3.24 37.7,30.25 37.95,29.99 U3.20 39.84,29.99 40.32,30.48 40.32,31.43 38.73,33.02 | 38.73,33.02 37.47,34.29 37.47,37.77 R17.1 38.43,38.1 U4.2 | U1.18 37.33,8.39 39.05,6.67 39.05,6.35 40.01,5.4 41.59,5.4 42.55,6.35 v42.55,6.67 | v38.73,32.38 38.73,33.02
  Bottom 0.254: v42.55,6.67 42.55,11.11 34.29,19.37 34.29,28.26 38.42,32.38 v38.73,32.38
SDA  (via drill 0.3)
  Top 0.254: U4.3 38.42,37.46 R16.1 38.1,37.13 38.1,34.29 40.96,31.43 40.96,30.48 39.92,29.44 U3.19 37.87,29.44 37.15,30.16 U3.25 v37.15,32.07 | U1.19 37.83,8.53 39.69,6.67 39.69,6.35 40.01,6.03 41.59,6.03 41.91,6.35 v41.91,7.94
  Bottom 0.254: v41.91,7.94 41.91,11.11 33.66,19.37 33.66,28.57 v37.15,32.07
TX  (via drill 0.3)
  Top 0.254: U2.13 30.73,46.04 | 30.73,46.04 30.73,45.97 29.84,45.09 29.84,44.6 Q3.2 28.44,43.95 R13.1 | U1.21 38.83,8.79 39.69,7.94 40.01,7.94 v41.27,6.67 | v30.8,22.86 30.48,22.86 30.16,23.18 30.16,25.08 27.62,27.62 27.62,29.84 31.43,33.66 31.43,40.96 31.75,41.27 31.75,45.02 30.73,46.04
  Bottom 0.254: v41.27,6.67 40.64,6.03 37.78,6.03 33.02,10.79 32.7,10.79 32.38,11.11 32.38,16.83 30.8,18.41 v30.8,22.86
TX_O
  Top 0.254: Q3.3 30.48,44.44 30.48,43.81 28.57,41.91 JP2.5 27.94,40.66 R15.1
VBUS  (via drill 0.5)
  Top 0.254: C11.1 31.33,11.43 31.75,11.43 32.52,12.2 U1.7
  Top 0.305: 22.85,10.17 22.87,10.17 23.5,10.79 24.36,10.79 | 24.36,11.66 U9.5 24.36,10.79 | C11.1 30.7,10.79 24.36,10.79 | 16.51,10.16 16.51,2.54 15.56,1.59 14.61,1.59 13.65,0.64 9.21,0.64 8.26,1.59 7.3,1.59 6.35,2.54 6.35,4.45 4.57,6.22 2.03,6.22 1.27,6.99 LED1.A 2.04,7.87 4.06,7.87 4.51,8.32 4.51,15.3 5.71,16.51 9.53,16.51 | 9.53,16.51 10.03,16.01 U6.2 | JP2.1 16.19,40.32 16.19,33.34 15.56,32.7 v15.56,32.07 | v12.7,19.68 9.53,16.51
  Top 0.406: 22.85,10.17 22.86,10.16 | 22.86,10.16 16.51,10.16 15.03,10.16 C9.1 | X1.VBUS 23.16,8.27 22.86,8.57 22.86,10.16
  Bottom 0.305: v15.56,32.07 12.7,29.21 v12.7,19.68
  pour Top (isolate 0.254, rank 3, no thermals): 10.16,12.06 13.97,12.06 13.97,10.79 10.16,10.79
VDIV  (via drill 0.3)
  Top 0.254: R10.1 R11.2 v26.99,15.88 | v31.11,6.99 31.11,4.76 34.61,1.27 39.05,1.27 44.13,6.35 44.13,10.79 43.73,11.2 U1.25
  Bottom 0.254: v26.99,15.88 27.94,14.92 27.94,9.21 30.16,6.99 v31.11,6.99
VIN
  Top 0.254: R15.2 26.66,38.1 25.4,38.1 R14.2 22.86,40.62 JP2.3

### Text on the board
tPlace: 43724 | RESET | SW2 | VBUS | 3V3 | VIN | RXI | TXO | GND | BT_R | 3V3 | GND | Adjacent | Reality | F0 | F1 | Y | Z | Node 0.1 | F4 | F5 | AVR ISP | F6 | F7 | X | HWB | SW1 | POWER
bPlace: Adjacent Reality Node 0.1 | Donald Cober & Nirav Patel | Creative Commons BY-SA 3.0 | https://github.com/dcoberii/ | http://adjacentreality.org